# Altium project ChassisPowerDistroA_1.1_GK.PrjPcb
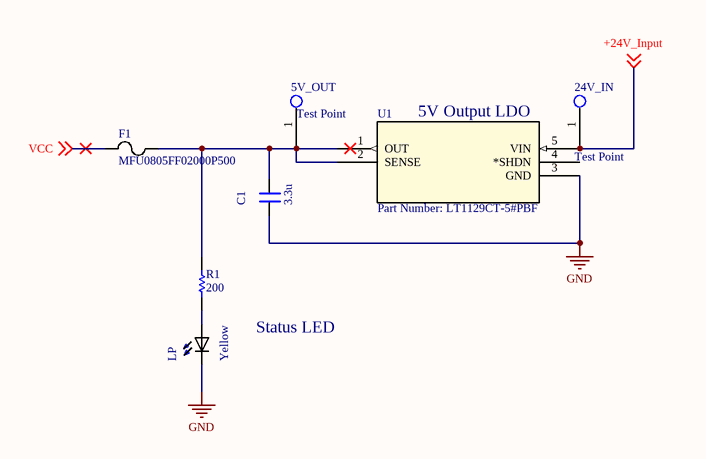
[diagram p0: Local_Power_5V_Rev1.1.SchDoc]
6 sheets, 197 parts. Net scope: global (net labels, ports and power ports of the same name join across sheets).
Board file: ChassisPowerDistroA_PSoC_1.1_GK.PcbDoc
Sheets:
  Local_Power_5V_Rev1.1.SchDoc
  MCU_PSoC_Rev1.1.SchDoc
  Power_12V_Rev1.1.SchDoc
  Power_3.3V_Rev1.1.SchDoc
  Power_5V_Rev1.1.SchDoc
  Power_24V_Rev1.1.SchDoc

## Sheet Local_Power_5V_Rev1.1.SchDoc
size A4

### Parts
5V_OUT  Test Point  [Test Point Through-hole]
24V_IN  Test Point  [Test Point Through-hole]
C1  3.3u  [*CAPC2012X88N]
F1  MFU0805FF02000P500  [FUS_VISHAY_MFU08]
LP  Yellow  [*DIOC200X125X110_LTST-C171KSKT(Primary)]
R1  200  [RESC0805(2012)_M]
U1  Part Number: LT1129CT-5#PBF  [TO220-5_T]

### Nets
GND: C1.1 LP.NEG U1.3(GND)
+24V_Input: 24V_IN.1 U1.5(VIN) ; off-sheet +24V_Input
VCC: F1.1 ; off-sheet VCC
Net5V_OUT_1: 5V_OUT.1 C1.2 F1.2 R1.2 U1.1(OUT) U1.2(SENSE)
NetLP_POS: LP.POS R1.1

Not connected (* = marked no-connect by the designer): U1 4(*SHDN)

### Notes on the sheet
- (near U1) 5V Output LDO
- Status LED
- Title
- Size:
- Date:
- A4
- Number:
- Time:
- Revision:
- Sheet
- of
- File:

### Library data of the parts
C1 = C0805C101JAGAC7800: / 100pF Â±5% 250V Ceramic Capacitor C0G, NP0 0805 _2012 Metric_ /; MF: KEMET; Package: 0805 KEMET; Digi-Key_Part_Number: 399-15000-1-ND; MP: C0805C101JAGAC7800; Digi-Key_Purchase_URL: https://www.digikey.com/product-detail/en/kemet/C0805C101JAGAC7800/399-15000-1-ND/7382549?utm_source=snapeda&utm_medium=aggregator&utm_campaign=symbol; SnapEDA_Link: https://www.snapeda.com/parts/C0805C101JAGAC7800/KEMET/view-part/3661430/?ref=snap; Value: *
F1 = MFU0805FF02000P5: No Description Available; Vendor: VISHAY; Built_By: EMA_UL_Team; Type: DEV; Manufacturer_Part_Number: MFU0805FF02000P500; Copyright: Copyright (C) 2018 Accelerated Designs. All rights reserved; RefDes: RefDes; Value: Value
LP = LTST-C171KSKT: / Yellow 2 x 1.25 x 0.8 mm 130Â° Water Clear 50 mcd 2 V LED SMT /; MF: Lite-On Inc.; SnapEDA_Link: https://www.snapeda.com/parts/LTST-C171KSKT/Lite-On%20Inc./view-part/?ref=snap; Package: 0805 Lite-On; MP: LTST-C171KSKT; Digi-Key_Part_Number: 160-1428-1-ND; Digi-Key_Purchase_URL: https://www.digikey.com/product-detail/en/lite-on-inc/LTST-C171KSKT/160-1428-1-ND/386802?utm_source=snapeda&utm_medium=aggregator&utm_campaign=symbol; Value: *
R1 = CMP-1013-00951-1: 8M06 0.125W 1% 0805 (2012 Metric)  SMD; Value: 8060000.00 Ohm; Case-EIA: 0805; Case-Metric: 2012; Power: 0.125 W; Technology: SMT; Tolerance: 1 %
U1 = LT1129CT-5#PBF: No Description Available; Vendor: Linear Technology; Built_By: EMA_UL_Team; Manufacturer_Part_Number: LT1129CT-5#PBF; Copyright: Copyright (C) 2018 Accelerated Designs. All rights reserved; RefDes: RefDes; Type: DEV; Value: Value

## Sheet MCU_PSoC_Rev1.1.SchDoc
size A4
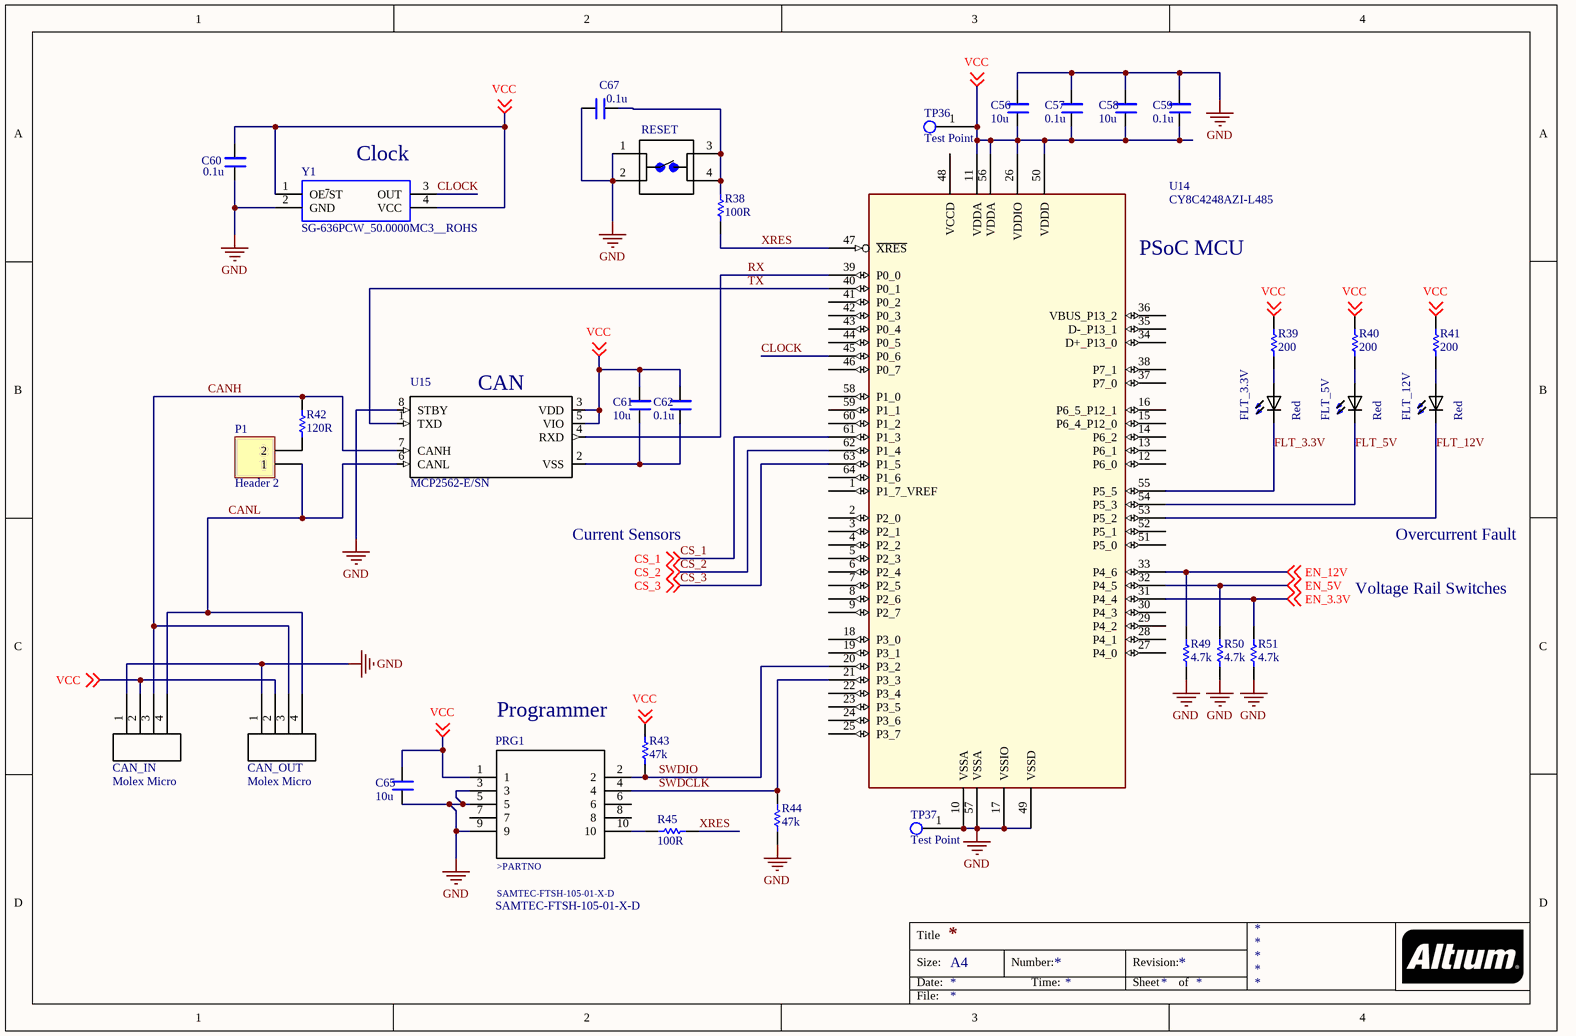
[diagram p1: MCU_PSoC_Rev1.1.SchDoc]

### Parts
C56  10u  [*CAPC2012X88N]
C57  0.1u  [*CAPC2012X88N]
C58  10u  [*CAPC2012X88N]
C59  0.1u  [*CAPC2012X88N]
C60  0.1u  [*CAPC2012X88N]
C61  10u  [*CAPC2012X88N]
C62  0.1u  [*CAPC2012X88N]
C65  10u  [*CAPC2012X88N]
C67  0.1u  [*CAPC2012X88N]
CAN_IN  Molex Micro  [0430450427]
CAN_OUT  Molex Micro  [0430450427]
FLT_3.3V  Red  [*DIOC200X125X110_LTST-C171KSKT(Primary)]
FLT_5V  Red  [*DIOC200X125X110_LTST-C171KSKT(Primary)]
FLT_12V  Red  [*DIOC200X125X110_LTST-C171KSKT(Primary)]
P1  Header 2  [HDR1X2]
PRG1  SAMTEC-FTSH-105-01-X-D  [SAMTEC-FTSH-105-01-X-D]
R38  100R  [RESC0805(2012)_M]
R39  200  [RESC0805(2012)_M]
R40  200  [RESC0805(2012)_M]
R41  200  [RESC0805(2012)_M]
R42  120R  [RESC0805(2012)_N]
R43  47k  [RESC0805(2012)_M]
R44  47k  [RESC0805(2012)_M]
R45  100R  [RESC0805(2012)_M]
R49  4.7k  [RESC0805(2012)_M]
R50  4.7k  [RESC0805(2012)_M]
R51  4.7k  [RESC0805(2012)_M]
RESET  1825910-7  [Switch 6mm 24V (NO)]  (value not drawn)
TP36  Test Point  [Test Point Through-hole]
TP37  Test Point  [Test Point Through-hole]
U14  CY8C4248AZI-L485  [TQFP50P1200X1200X160-64N]
U15  MCP2562-E/SN  [SOIC127P600X175-8N]
Y1  SG-636PCW_50.0000MC3__ROHS  [SG-636]

### Nets
GND: C56.2 C57.2 C58.2 C59.2 C60.1 C65.1 C67.1 CAN_IN.1 CAN_OUT.1 PRG1.3 PRG1.5 PRG1.9 R44.2 R49.2 R50.2 R51.2 RESET.1 RESET.2 TP37.1 U14.10(VSSA) U14.17(VSSIO) U14.49(VSSD) U14.57(VSSA) U15.8(STBY) Y1.2(GND)
CANH: CAN_IN.3 CAN_OUT.3 R42.2 U15.7(CANH)
CANL: CAN_IN.4 CAN_OUT.4 P1.1 U15.6(CANL)
CLOCK: U14.45(P0_6) Y1.3(OUT)
CS_1: U14.61(P1_3) ; off-sheet CS_1
CS_2: U14.62(P1_4) ; off-sheet CS_2
CS_3: U14.63(P1_5) ; off-sheet CS_3
EN_3.3V: R51.1 U14.31(P4_4) ; off-sheet EN_3.3V
EN_5V: R50.1 U14.32(P4_5) ; off-sheet EN_5V
EN_12V: R49.1 U14.33(P4_6) ; off-sheet EN_12V
FLT_3.3V: FLT_3.3V.NEG U14.55(P5_5)
FLT_5V: FLT_5V.NEG U14.54(P5_3)
FLT_12V: FLT_12V.NEG U14.53(P5_2)
RX: U14.39(P0_0) U15.4(RXD)
SWDCLK: PRG1.4 R44.1 U14.21(P3_3)
SWDIO: PRG1.2 R43.2 U14.20(P3_2)
TX: U14.40(P0_1) U15.1(TXD)
VCC: C56.1 C57.1 C58.1 C59.1 C60.2 C61.2 C62.2 C65.2 CAN_IN.2 CAN_OUT.2 PRG1.1 R39.2 R40.2 R41.2 R43.1 TP36.1 U14.11(VDDA) U14.26(VDDIO) U14.50(VDDD) U14.56(VDDA) U15.3(VDD) U15.5(VIO) Y1.1(OE~{/}ST) Y1.4(VCC) ; off-sheet VCC
XRES: R38.2 R45.1 U14.47(~{XRES})
NetC61_1: C61.1 C62.1 U15.2(VSS)
NetC67_2: C67.2 R38.1 RESET.3 RESET.4
NetFLT_3.3V_POS: FLT_3.3V.POS R39.1
NetFLT_5V_POS: FLT_5V.POS R40.1
NetFLT_12V_POS: FLT_12V.POS R41.1
NetP1_2: P1.2 R42.1
NetPRG1_10: PRG1.10 R45.2

Not connected (* = marked no-connect by the designer): PRG1 6 7 8; U14 1(P1_7_VREF) 2(P2_0) 3(P2_1) 4(P2_2) 5(P2_3) 6(P2_4) 7(P2_5) 8(P2_6) 9(P2_7) 12(P6_0) 13(P6_1) 14(P6_2) 15(P6_4_P12_0) 16(P6_5_P12_1) 18(P3_0) 19(P3_1) 22(P3_4) 23(P3_5) 24(P3_6) 25(P3_7) 27(P4_0) 28(P4_1) 29(P4_2) 30(P4_3) 34(D+_P13_0) 35(D-_P13_1) 36(VBUS_P13_2) 37(P7_0) 38(P7_1) 41(P0_2) 42(P0_3) 43(P0_4) 44(P0_5) 46(P0_7) 48(VCCD) 51(P5_0) 52(P5_1) 58(P1_0) 59(P1_1) 60(P1_2) 64(P1_6)

### Notes on the sheet
- (near Y1) Clock
- (near U14) PSoC MCU
- (near U15) CAN
- Current Sensors
- Overcurrent Fault
- Voltage Rail Switches
- Programmer
- Title
- Size:
- Date:
- A4
- Number:
- Time:
- Revision:
- Sheet
- of
- File:
- (in symbol SAMTEC-FTSH-105-01-X-D) >PARTNO

### Library data of the parts
C56-C62 C65 C67 = C0805C101JAGAC7800: as C1 on sheet Local_Power_5V_Rev1.1; Package: 0805 KEMET; Digi-Key_Part_Number: 399-15000-1-ND; MP: C0805C101JAGAC7800; Digi-Key_Purchase_URL: https://www.digikey.com/product-detail/en/kemet/C0805C101JAGAC7800/399-15000-1-ND/7382549?utm_source=snapeda&utm_medium=aggregator&utm_campaign=symbol; SnapEDA_Link: https://www.snapeda.com/parts/C0805C101JAGAC7800/KEMET/view-part/3661430/?ref=snap; Value: *
CAN_IN CAN_OUT = Molex micro-fit 4-pin (Single row schematic): Molex micro-fit 3.0 dual row header. P/N 0430450427
FLT_3.3V FLT_5V FLT_12V = LTST-C171KSKT: as LP on sheet Local_Power_5V_Rev1.1; SnapEDA_Link: https://www.snapeda.com/parts/LTST-C171KSKT/Lite-On%20Inc./view-part/?ref=snap; Package: 0805 Lite-On; MP: LTST-C171KSKT; Digi-Key_Part_Number: 160-1428-1-ND; Digi-Key_Purchase_URL: https://www.digikey.com/product-detail/en/lite-on-inc/LTST-C171KSKT/160-1428-1-ND/386802?utm_source=snapeda&utm_medium=aggregator&utm_campaign=symbol; Value: *
P1 = Header 2: Header, 2-Pin; LatestRevisionDate: 17-Jul-2002; LatestRevisionNote: Re-released for DXP Platform.; Publisher: Altium Limited
PRG1 = SAMTEC-FTSH-105-01-X-D: SAMTEC-FTSH-105-01-X-D. Shrouded 10-pin header with .05 in pitch.
R38-R41 R43-R45 R49-R51 = CMP-1013-00951-1: as R1 on sheet Local_Power_5V_Rev1.1; Power: 0.125 W; Technology: SMT; Tolerance: 1 %
R42 = 120R 5% 0805: 120R 0.125W 5% 0805 (2012 Metric)  SMD; Case-Metric: 2012; Value: 120.00 Ohm; Case-EIA: 0805; Tolerance: 5 %; Technology: SMT; Power: 0.125 W
RESET = Switch 6mm 24V (NO): FSM4JAH=6MM TACT SWITCH, HIGH TEMP; MF: TE Connectivity; Contact_Current_Rating: 50 mA; Configuration_Pole-Throw: Single Pole - Single Throw; Package: None; Digi-Key_Part_Number: 450-1804-ND; Digi-Key_Purchase_URL: https://www.digikey.com/product-detail/en/te-connectivity-alcoswitch-switches/1825910-7/450-1804-ND/1731414?utm_source=snapeda&utm_medium=aggregator&utm_campaign=symbol; MP: 1825910-7; SnapEDA_Link: https://www.snapeda.com/parts/1825910-7/TE%20Connectivity%20ALCOSWITCH%20Switches/view-part/?ref=snap; EU_RoHS_Compliance: Compliant; TE_purchase_URL: https://www.te.com/usa-en/product-1825910-7.html?te_bu=Cor&te_type=disp&te_campaign=seda_glo_cor-seda-global-disp-prtnr-fy19-seda-model-bom-cta_sma-317_1&elqCampaignId=32493; Value: *
U15 = MCP2562-E/SN: Microchip MCP2562-E/SN, CAN Transceiver 1MBps 1-channel IEC 61000-4-2, 8-Pin SOIC; Price: None; MF: Microchip; SnapEDA_Link: https://www.snapeda.com/parts/MCP2562-E/SN/Microchip/view-part/?ref=snap; MP: MCP2562-E/SN; Availability: Unavailable; Package: SO-8 Microchip; Value: *
Y1 = SG-636: Standard Clock Oscillators 50MHz 3.3Volt 100ppm -20C +70C; Manufacturer_Name: Epson Timing; Manufacturer_Part_Number: SG-636PCW 50.0000MC3: ROHS; RS Part Number: *; RS Price/Stock: *; Arrow Part Number: SG-636PCW 50.0000MC3: ROHS; Arrow Price/Stock: *; Datasheet Link: http://www.mouser.com/ds/2/137/G-636PCE_en-1003252.pdf
U14 = CY8C4248AZI-L485: Part_Number: CY8C4248AZI-L485

## Sheet Power_12V_Rev1.1.SchDoc
size B
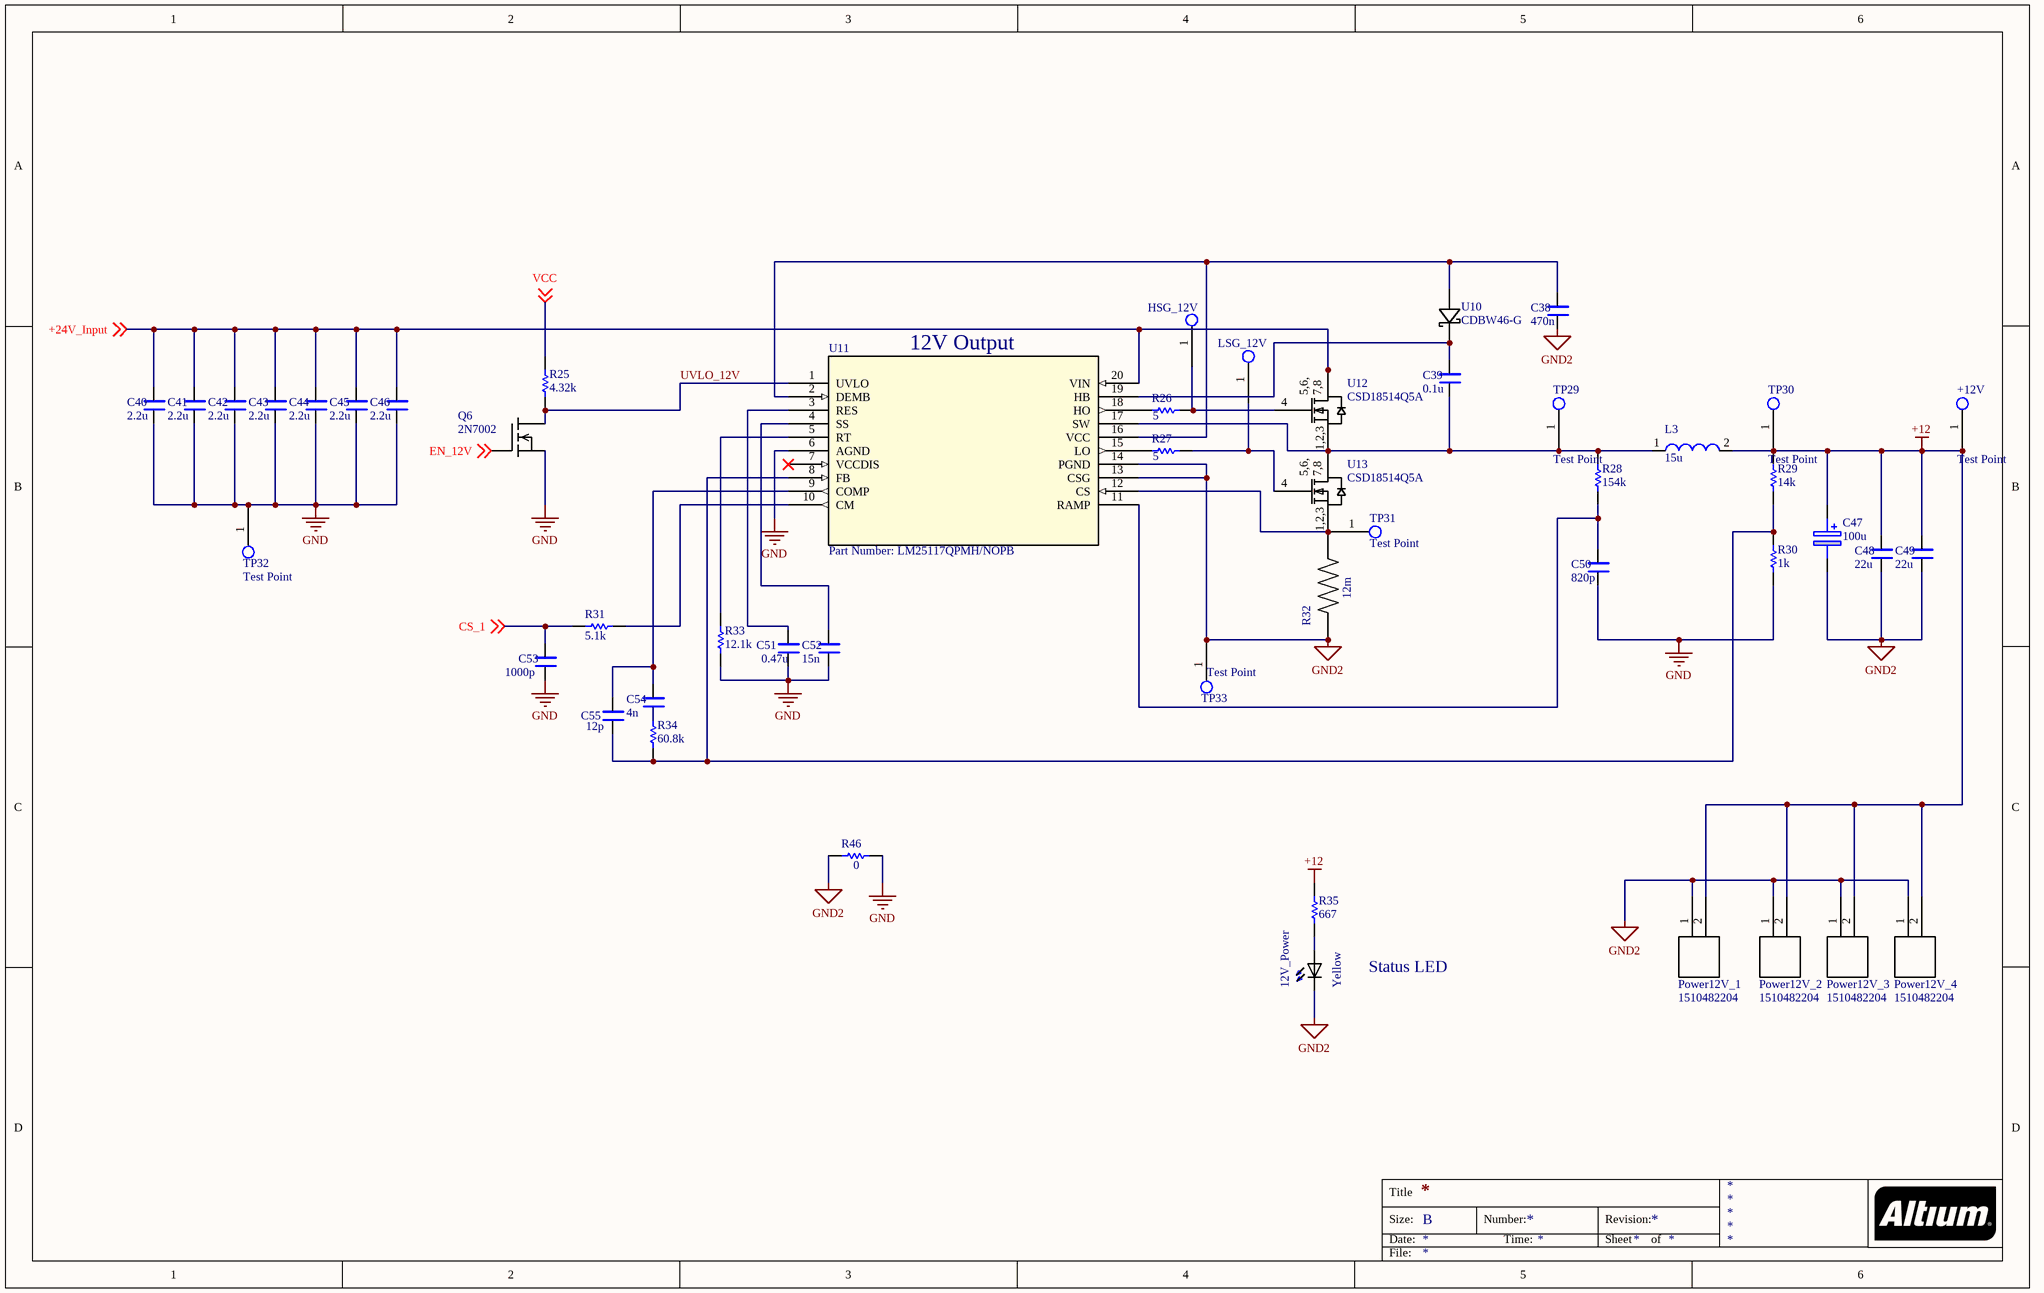
[diagram p2: Power_12V_Rev1.1.SchDoc]

### Parts
12V_Power  Yellow  [*DIOC200X125X110_LTST-C171KSKT(Primary)]
+12V  Test Point  [Test Point Through-hole]
C38  470n  [*CAPC2012X88N]
C39  0.1u  [*CAPC2012X88N]
C40  2.2u  [*CAPC2012X88N]
C41  2.2u  [*CAPC2012X88N]
C42  2.2u  [*CAPC2012X88N]
C43  2.2u  [*CAPC2012X88N]
C44  2.2u  [*CAPC2012X88N]
C45  2.2u  [*CAPC2012X88N]
C46  2.2u  [*CAPC2012X88N]
C47  100u  [CAPPRD500W65D1000H1800]
C48  22u  [*CAPC2012X88N]
C49  22u  [*CAPC2012X88N]
C50  820p  [*CAPC2012X88N]
C51  0.47u  [*CAPC2012X88N]
C52  15n  [*CAPC2012X88N]
C53  1000p  [*CAPC2012X88N]
C54  4n  [*CAPC2012X88N]
C55  12p  [*CAPC2012X88N]
HSG_12V  (no value)  [Test Point Through-hole]
L3  15u  [XAL1010-682]
LSG_12V  (no value)  [Test Point Through-hole]
Power12V_1  1510482204  [1510482204]
Power12V_2  1510482204  [1510482204]
Power12V_3  1510482204  [1510482204]
Power12V_4  1510482204  [1510482204]
Q6  2N7002  [*SOT23]
R25  4.32k  [RESC0805(2012)_M]
R26  5  [AXIAL-0.3]
R27  5  [AXIAL-0.3]
R28  154k  [RESC0805(2012)_M]
R29  14k  [RESC0805(2012)_M]
R30  1k  [RESC0805(2012)_M]
R31  5.1k  [RESC0805(2012)_M]
R32  12m  [*RESC6432X110N]
R33  12.1k  [RESC0805(2012)_M]
R34  60.8k  [RESC0805(2012)_M]
R35  667  [RESC0805(2012)_M]
R46  0  [RESC0805(2012)_M]
TP29  Test Point  [Test Point Through-hole]
TP30  Test Point  [Test Point Through-hole]
TP31  Test Point  [Test Point Through-hole]
TP32  Test Point  [Test Point Through-hole]
TP33  Test Point  [Test Point Through-hole]
U10  CDBW46-G  [CDBW]
U11  Part Number: LM25117QPMH/NOPB  [MXA20A]
U12  CSD18514Q5A  [DQJ0008A]
U13  CSD18514Q5A  [DQJ0008A]

### Nets
+12: +12V.1 C47.1(+) C48.2 C49.2 L3.2 Power12V_1.2 Power12V_2.2 Power12V_3.2 Power12V_4.2 R29.2 R35.2 TP30.1
GND: C40.1 C41.1 C42.1 C43.1 C44.1 C45.1 C46.1 C50.1 C51.1 C52.1 C53.1 Q6.2(S) R30.1 R33.1 R46.1 TP32.1 U11.6(AGND)
GND2: 12V_Power.NEG C38.1 C47.2(-) C48.1 C49.1 Power12V_1.1 Power12V_2.1 Power12V_3.1 Power12V_4.1 R32.1 R46.2 TP33.1 U11.13(CSG) U11.14(PGND)
+24V_Input: C40.2 C41.2 C42.2 C43.2 C44.2 C45.2 C46.2 U11.20(VIN) U12.5(D) U12.6(D) U12.7(D) U12.8(D) ; off-sheet +24V_Input
CS_1: C53.2 R31.2 ; off-sheet CS_1
EN_12V: Q6.1(G) ; off-sheet EN_12V
UVLO_12V: Q6.3(D) R25.1 U11.1(UVLO)
VCC: R25.2 ; off-sheet VCC
Net12V_Power_POS: 12V_Power.POS R35.1
NetC38_2: C38.2 U10.2 U11.2(DEMB) U11.16(VCC)
NetC39_1: C39.1 L3.1 R28.2 TP29.1 U11.17(SW) U12.1(S) U12.2(S) U12.3(S) U13.5(D) U13.6(D) U13.7(D) U13.8(D)
NetC39_2: C39.2 U10.1 U11.19(HB)
NetC50_2: C50.2 R28.1 U11.11(RAMP)
NetC51_2: C51.2 U11.3(RES)
NetC52_2: C52.2 U11.4(SS)
NetC54_1: C54.1 R34.2
NetC54_2: C54.2 C55.2 U11.9(COMP)
NetC55_1: C55.1 R29.1 R30.2 R34.1 U11.8(FB)
NetHSG_12V_1: HSG_12V.1 R26.2 U12.4(G)
NetLSG_12V_1: LSG_12V.1 R27.2 U13.4(G)
NetR26_1: R26.1 U11.18(HO)
NetR27_1: R27.1 U11.15(LO)
NetR31_1: R31.1 U11.10(CM)
NetR32_2: R32.2 TP31.1 U11.12(CS) U13.1(S) U13.2(S) U13.3(S)
NetR33_2: R33.2 U11.5(RT)

Not connected (* = marked no-connect by the designer): U11 7(VCCDIS)*

### Notes on the sheet
- (near U11) 12V Output
- Status LED
- Title
- Size:
- Date:
- B
- Number:
- Time:
- Revision:
- Sheet
- of
- File:
- (in symbol CSD18514Q5A) 5,6,; 7,8; 1,2,3

### Library data of the parts
12V_Power = LTST-C171KSKT: as LP on sheet Local_Power_5V_Rev1.1; SnapEDA_Link: https://www.snapeda.com/parts/LTST-C171KSKT/Lite-On%20Inc./view-part/?ref=snap; Package: 0805 Lite-On; MP: LTST-C171KSKT; Digi-Key_Part_Number: 160-1428-1-ND; Digi-Key_Purchase_URL: https://www.digikey.com/product-detail/en/lite-on-inc/LTST-C171KSKT/160-1428-1-ND/386802?utm_source=snapeda&utm_medium=aggregator&utm_campaign=symbol; Value: *
C38-C46 C48-C55 = C0805C101JAGAC7800: as C1 on sheet Local_Power_5V_Rev1.1; Package: 0805 KEMET; Digi-Key_Part_Number: 399-15000-1-ND; MP: C0805C101JAGAC7800; Digi-Key_Purchase_URL: https://www.digikey.com/product-detail/en/kemet/C0805C101JAGAC7800/399-15000-1-ND/7382549?utm_source=snapeda&utm_medium=aggregator&utm_campaign=symbol; SnapEDA_Link: https://www.snapeda.com/parts/C0805C101JAGAC7800/KEMET/view-part/3661430/?ref=snap; Value: *
C47 = EEUFC1V331: FC radial elec cap,330uF 35V Panasonic Aluminium Electrolytic Capacitor 330F 35 V dc 10mm Through Hole series FC Radial lifetime 3000h; Allied_Number: 70068521; Geometry.Height: 18mm; Manufacturer_Name: Panasonic; Manufacturer_Part_Number: EEUFC1V331; RS Part Number: 1081337; RS Price/Stock: http://uk.rs-online.com/web/p/products/1081337; Allied Price/Stock: https://www.alliedelec.com/panasonic-eeufc1v331/70068521/; Mouser Part Number: 1081337; Mouser Price/Stock: http://uk.rs-online.com/web/p/products/1081337; Datasheet Link: https://industrial.panasonic.com/cdbs/www-data/pdf/RDF0000/ABA0000C1209.pdf
HSG_12V LSG_12V = Test Point
L3 = SER2915H-153KL: Power inductor, high current, 10% tol, SMT, RoHS; MF: Coilcraft; Price: None; Package: None; SnapEDA_Link: https://www.snapeda.com/parts/SER2915H-153KL/Coilcraft/view-part/493862/?ref=snap; Availability: Unavailable; MP: SER2915H-153KL; Value: *
Power12V_1-Power12V_4 = 1510482204: Molex 6.5MM 2 pin connector, used for power connections. P/N 1510482204 and similar models.
Q6 = 2N7002: Trans MOSFET N-CH 60V 0.115A 3-Pin SOT-23 T/R; MF: ON Semiconductor; Price: None; SnapEDA_Link: https://www.snapeda.com/parts/2N7002/ON%20Semiconductor/view-part/4449003/?ref=snap; Availability: Unavailable; Package: SOT-23-3 ON Semiconductor; MP: 2N7002; Value: *
R25 R28-R31 R33-R35 R46 = CMP-1013-00951-1: as R1 on sheet Local_Power_5V_Rev1.1; Power: 0.125 W; Technology: SMT; Tolerance: 1 %
R26 R27 = 120R 5% 0805: as R42 on sheet MCU_PSoC_Rev1.1; Tolerance: 5 %; Technology: SMT; Power: 0.125 W
R32 = ERJ-M1WSF12MU: Res Thick Film 2512 0.012 Ohm 1% 1W Pad SMD Automotive T/R; MF: Panasonic; MP: ERJ-M1WSF12MU; Package: 6432 Panasonic Electronic Components; Digi-Key_Purchase_URL: https://www.digikey.com/product-detail/en/panasonic-electronic-components/ERJ-M1WSF12MU/P12MCT-ND/300474?utm_source=snapeda&utm_medium=aggregator&utm_campaign=symbol; Digi-Key_Part_Number: P12MCT-ND; SnapEDA_Link: https://www.snapeda.com/parts/ERJ-M1WSF12MU/Panasonic/view-part/?ref=snap; Value: *
U10 = CDBW46-G: No Description Available; Vendor: Comchip; Built_By: EMA_UL_Team; Manufacturer_Part_Number: CDBW46-G; Copyright: Copyright (C) 2018 Accelerated Designs. All rights reserved; RefDes: RefDes; Type: DEV; Value: Value
U11 = LM25117QPMH/NOPB: No Description Available; Manufacturer: Texas Instruments; Built_By: EMA_UL_Team; Manufacturer_Part_Number: LM25117QPMH/NOPB; Vendor: Texas Instruments; Copyright: Copyright (C) 2018 Accelerated Designs. All rights reserved; RefDes: RefDes; Type: DEV; Value: Value
U12 U13 = CSD18514Q5A: No Description Available; Vendor: Texas Instruments; Built_By: Texas_Instrument_Team; Value: 40V; VALUE_2: Value; Manufacturer_Part_Number: CSD18514Q5A; Copyright: Copyright (C) 2018 Accelerated Designs. All rights reserved; RefDes: RefDes; Type: DEV

## Sheet Power_3.3V_Rev1.1.SchDoc
size B
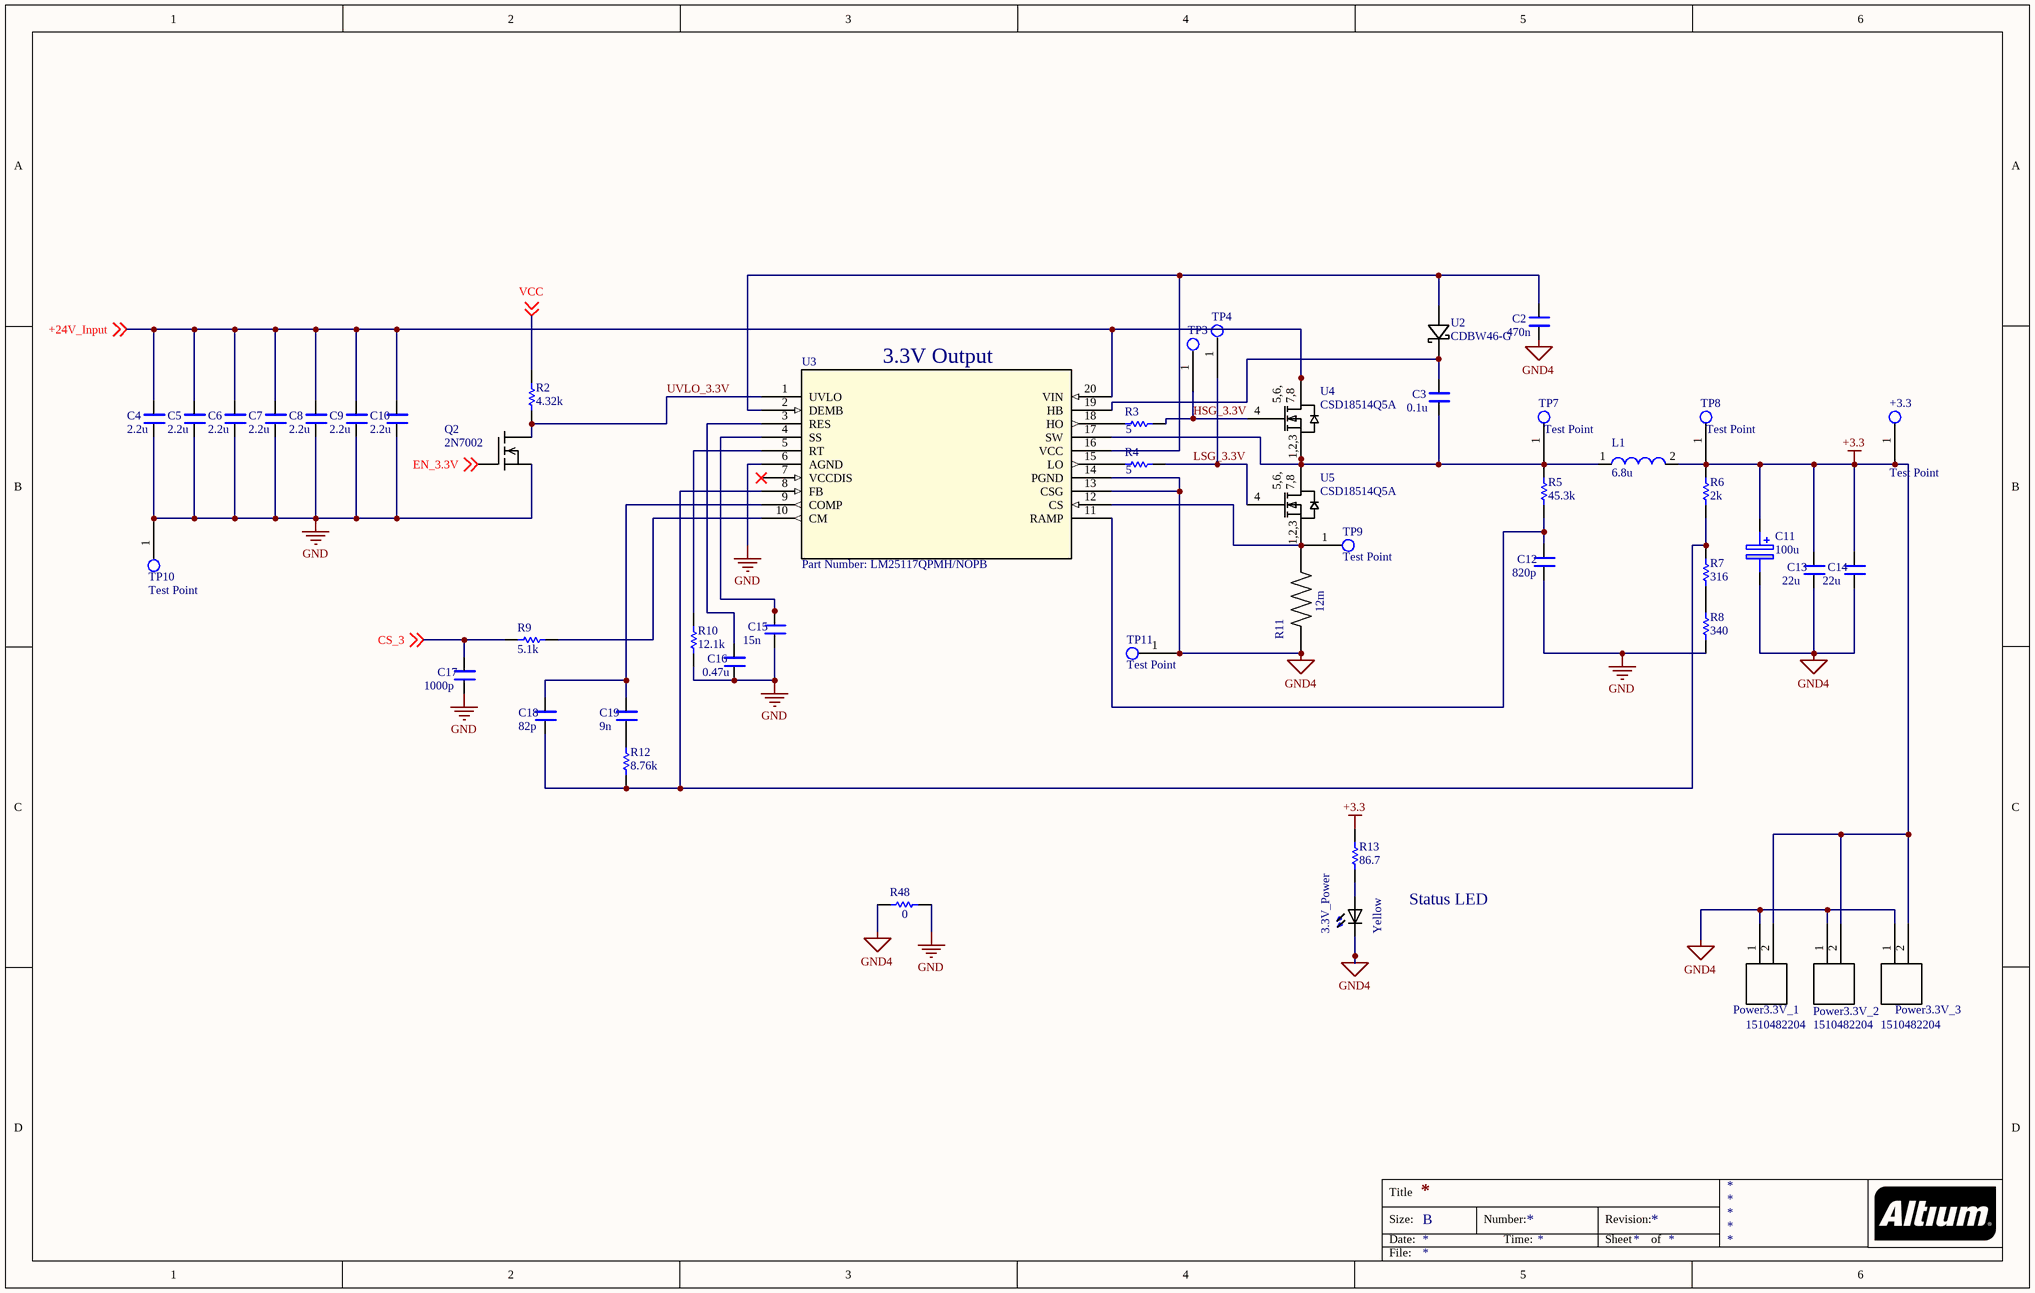
[diagram p3: Power_3.3V_Rev1.1.SchDoc]

### Parts
3.3V_Power  Yellow  [*DIOC200X125X110_LTST-C171KSKT(Primary)]
+3.3  Test Point  [Test Point Through-hole]
C2  470n  [*CAPC2012X88N]
C3  0.1u  [*CAPC2012X88N]
C4  2.2u  [*CAPC2012X88N]
C5  2.2u  [*CAPC2012X88N]
C6  2.2u  [*CAPC2012X88N]
C7  2.2u  [*CAPC2012X88N]
C8  2.2u  [*CAPC2012X88N]
C9  2.2u  [*CAPC2012X88N]
C10  2.2u  [*CAPC2012X88N]
C11  100u  [CAPPRD500W65D1000H1800]
C12  820p  [*CAPC2012X88N]
C13  22u  [*CAPC2012X88N]
C14  22u  [*CAPC2012X88N]
C15  15n  [*CAPC2012X88N]
C16  0.47u  [*CAPC2012X88N]
C17  1000p  [*CAPC2012X88N]
C18  82p  [*CAPC2012X88N]
C19  9n  [*CAPC2012X88N]
L1  6.8u  [XAL1010-682]
Power3.3V_1  1510482204  [1510482204]
Power3.3V_2  1510482204  [1510482204]
Power3.3V_3  1510482204  [1510482204]
Q2  2N7002  [*SOT23]
R2  4.32k  [RESC0805(2012)_M]
R3  5  [AXIAL-0.3]
R4  5  [AXIAL-0.3]
R5  45.3k  [RESC0805(2012)_M]
R6  2k  [RESC0805(2012)_M]
R7  316  [RESC0805(2012)_M]
R8  340  [RESC0805(2012)_M]
R9  5.1k  [RESC0805(2012)_M]
R10  12.1k  [RESC0805(2012)_M]
R11  12m  [*RESC6432X110N]
R12  8.76k  [RESC0805(2012)_M]
R13  86.7  [RESC0805(2012)_M]
R48  0  [RESC0805(2012)_M]
TP3  (no value)  [Test Point Through-hole]
TP4  (no value)  [Test Point Through-hole]
TP7  Test Point  [Test Point Through-hole]
TP8  Test Point  [Test Point Through-hole]
TP9  Test Point  [Test Point Through-hole]
TP10  Test Point  [Test Point Through-hole]
TP11  Test Point  [Test Point Through-hole]
U2  CDBW46-G  [CDBW]
U3  Part Number: LM25117QPMH/NOPB  [MXA20A]
U4  CSD18514Q5A  [DQJ0008A]
U5  CSD18514Q5A  [DQJ0008A]

### Nets
+3.3: +3.3.1 C11.1(+) C13.2 C14.2 L1.2 Power3.3V_1.2 Power3.3V_2.2 Power3.3V_3.2 R6.2 R13.2 TP8.1
GND: C4.1 C5.1 C6.1 C7.1 C8.1 C9.1 C10.1 C12.1 C15.1 C16.1 C17.1 Q2.2(S) R8.1 R10.1 R48.1 TP10.1 U3.6(AGND)
GND4: 3.3V_Power.NEG C2.1 C11.2(-) C13.1 C14.1 Power3.3V_1.1 Power3.3V_2.1 Power3.3V_3.1 R11.1 R48.2 TP11.1 U3.13(CSG) U3.14(PGND)
+24V_Input: C4.2 C5.2 C6.2 C7.2 C8.2 C9.2 C10.2 U3.20(VIN) U4.5(D) U4.6(D) U4.7(D) U4.8(D) ; off-sheet +24V_Input
CS_3: C17.2 R9.2 ; off-sheet CS_3
EN_3.3V: Q2.1(G) ; off-sheet EN_3.3V
HSG_3.3V: R3.2 TP3.1 U4.4(G)
LSG_3.3V: R4.2 TP4.1 U5.4(G)
UVLO_3.3V: Q2.3(D) R2.1 U3.1(UVLO)
VCC: R2.2 ; off-sheet VCC
Net3.3V_Power_POS: 3.3V_Power.POS R13.1
NetC2_2: C2.2 U2.2 U3.2(DEMB) U3.16(VCC)
NetC3_1: C3.1 L1.1 R5.2 TP7.1 U3.17(SW) U4.1(S) U4.2(S) U4.3(S) U5.5(D) U5.6(D) U5.7(D) U5.8(D)
NetC3_2: C3.2 U2.1 U3.19(HB)
NetC12_2: C12.2 R5.1 U3.11(RAMP)
NetC15_2: C15.2 U3.4(SS)
NetC16_2: C16.2 U3.3(RES)
NetC18_1: C18.1 R6.1 R7.2 R12.1 U3.8(FB)
NetC18_2: C18.2 C19.2 U3.9(COMP)
NetC19_1: C19.1 R12.2
NetR3_1: R3.1 U3.18(HO)
NetR4_1: R4.1 U3.15(LO)
NetR7_1: R7.1 R8.2
NetR9_1: R9.1 U3.10(CM)
NetR10_2: R10.2 U3.5(RT)
NetR11_2: R11.2 TP9.1 U3.12(CS) U5.1(S) U5.2(S) U5.3(S)

Not connected (* = marked no-connect by the designer): U3 7(VCCDIS)*

### Notes on the sheet
- (near U3) 3.3V Output
- Status LED
- Title
- Size:
- Date:
- B
- Number:
- Time:
- Revision:
- Sheet
- of
- File:
- (in symbol CSD18514Q5A) 5,6,; 7,8; 1,2,3

### Library data of the parts
3.3V_Power = LTST-C171KSKT: as LP on sheet Local_Power_5V_Rev1.1; SnapEDA_Link: https://www.snapeda.com/parts/LTST-C171KSKT/Lite-On%20Inc./view-part/?ref=snap; Package: 0805 Lite-On; MP: LTST-C171KSKT; Digi-Key_Part_Number: 160-1428-1-ND; Digi-Key_Purchase_URL: https://www.digikey.com/product-detail/en/lite-on-inc/LTST-C171KSKT/160-1428-1-ND/386802?utm_source=snapeda&utm_medium=aggregator&utm_campaign=symbol; Value: *
C2-C10 C12-C19 = C0805C101JAGAC7800: as C1 on sheet Local_Power_5V_Rev1.1; Package: 0805 KEMET; Digi-Key_Part_Number: 399-15000-1-ND; MP: C0805C101JAGAC7800; Digi-Key_Purchase_URL: https://www.digikey.com/product-detail/en/kemet/C0805C101JAGAC7800/399-15000-1-ND/7382549?utm_source=snapeda&utm_medium=aggregator&utm_campaign=symbol; SnapEDA_Link: https://www.snapeda.com/parts/C0805C101JAGAC7800/KEMET/view-part/3661430/?ref=snap; Value: *
C11 = EEUFC1V331: as C47 on sheet Power_12V_Rev1.1; Manufacturer_Name: Panasonic; Manufacturer_Part_Number: EEUFC1V331; RS Part Number: 1081337; RS Price/Stock: http://uk.rs-online.com/web/p/products/1081337; Allied Price/Stock: https://www.alliedelec.com/panasonic-eeufc1v331/70068521/; Mouser Part Number: 1081337; Mouser Price/Stock: http://uk.rs-online.com/web/p/products/1081337; Datasheet Link: https://industrial.panasonic.com/cdbs/www-data/pdf/RDF0000/ABA0000C1209.pdf
L1 = SER2915H-153KL: as L3 on sheet Power_12V_Rev1.1; Price: None; Package: None; SnapEDA_Link: https://www.snapeda.com/parts/SER2915H-153KL/Coilcraft/view-part/493862/?ref=snap; Availability: Unavailable; MP: SER2915H-153KL; Value: *
Power3.3V_1-Power3.3V_3 = 1510482204: as Power12V_1 on sheet Power_12V_Rev1.1
Q2 = 2N7002: as Q6 on sheet Power_12V_Rev1.1; Price: None; SnapEDA_Link: https://www.snapeda.com/parts/2N7002/ON%20Semiconductor/view-part/4449003/?ref=snap; Availability: Unavailable; Package: SOT-23-3 ON Semiconductor; MP: 2N7002; Value: *
R2 R5-R10 R12 R13 R48 = CMP-1013-00951-1: as R1 on sheet Local_Power_5V_Rev1.1; Power: 0.125 W; Technology: SMT; Tolerance: 1 %
R3 R4 = 120R 5% 0805: as R42 on sheet MCU_PSoC_Rev1.1; Tolerance: 5 %; Technology: SMT; Power: 0.125 W
R11 = ERJ-M1WSF12MU: as R32 on sheet Power_12V_Rev1.1; MP: ERJ-M1WSF12MU; Package: 6432 Panasonic Electronic Components; Digi-Key_Purchase_URL: https://www.digikey.com/product-detail/en/panasonic-electronic-components/ERJ-M1WSF12MU/P12MCT-ND/300474?utm_source=snapeda&utm_medium=aggregator&utm_campaign=symbol; Digi-Key_Part_Number: P12MCT-ND; SnapEDA_Link: https://www.snapeda.com/parts/ERJ-M1WSF12MU/Panasonic/view-part/?ref=snap; Value: *
TP3 TP4 = Test Point
U2 = CDBW46-G: as U10 on sheet Power_12V_Rev1.1; Manufacturer_Part_Number: CDBW46-G; Copyright: Copyright (C) 2018 Accelerated Designs. All rights reserved; RefDes: RefDes; Type: DEV; Value: Value
U3 = LM25117QPMH/NOPB: as U11 on sheet Power_12V_Rev1.1; Manufacturer_Part_Number: LM25117QPMH/NOPB; Vendor: Texas Instruments; Copyright: Copyright (C) 2018 Accelerated Designs. All rights reserved; RefDes: RefDes; Type: DEV; Value: Value
U4 U5 = CSD18514Q5A: as U12 on sheet Power_12V_Rev1.1; Manufacturer_Part_Number: CSD18514Q5A; Copyright: Copyright (C) 2018 Accelerated Designs. All rights reserved; RefDes: RefDes; Type: DEV

## Sheet Power_5V_Rev1.1.SchDoc
size B
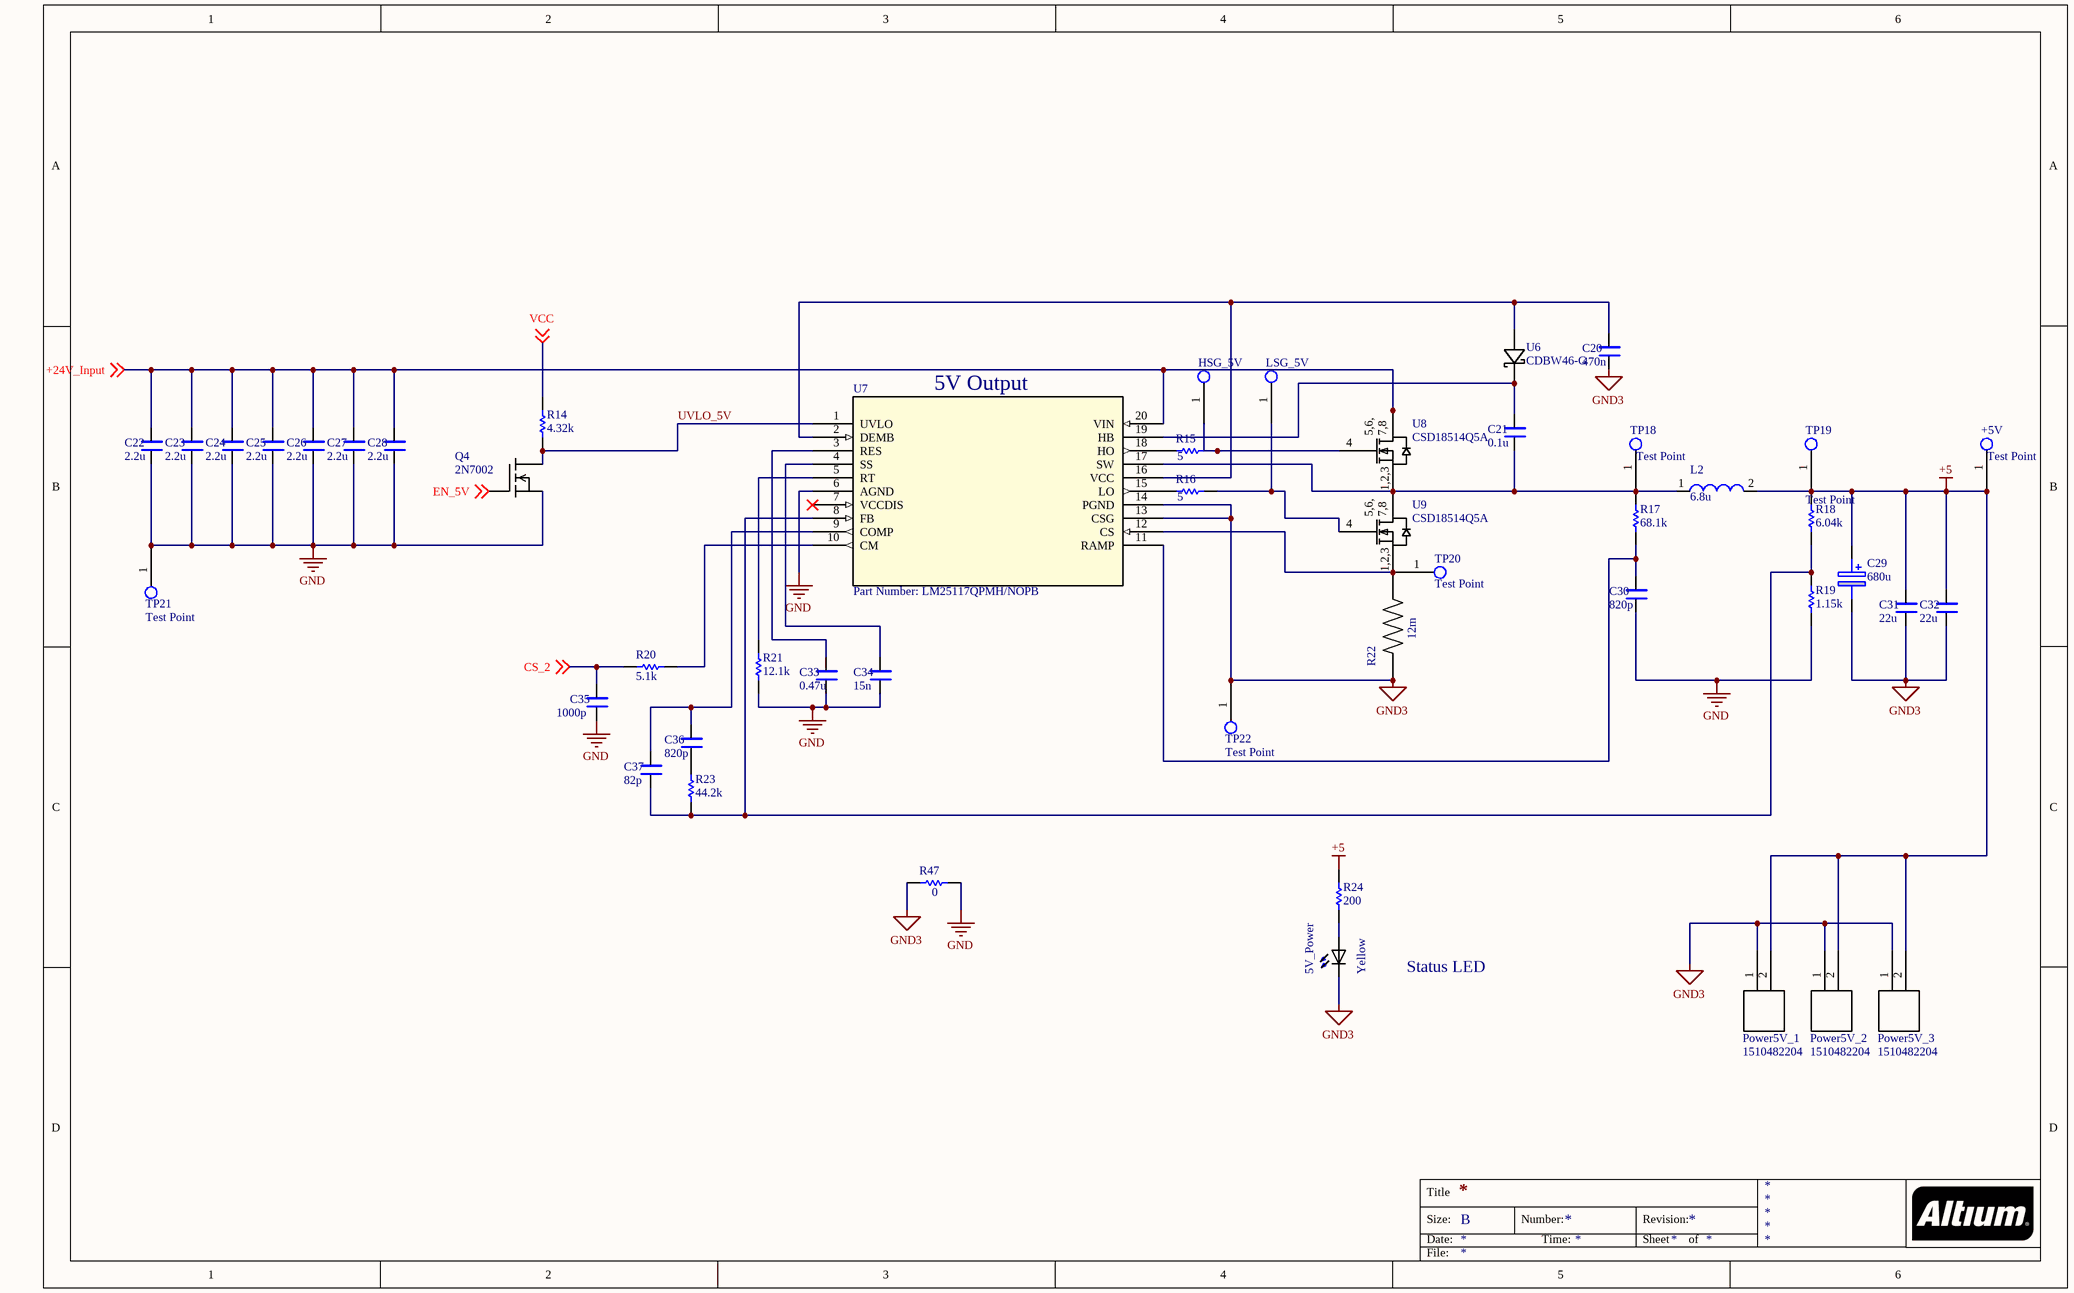
[diagram p4: Power_5V_Rev1.1.SchDoc]

### Parts
5V_Power  Yellow  [*DIOC200X125X110_LTST-C171KSKT(Primary)]
+5V  Test Point  [Test Point Through-hole]
C20  470n  [*CAPC2012X88N]
C21  0.1u  [*CAPC2012X88N]
C22  2.2u  [*CAPC2012X88N]
C23  2.2u  [*CAPC2012X88N]
C24  2.2u  [*CAPC2012X88N]
C25  2.2u  [*CAPC2012X88N]
C26  2.2u  [*CAPC2012X88N]
C27  2.2u  [*CAPC2012X88N]
C28  2.2u  [*CAPC2012X88N]
C29  680u  [CAPPRD500W65D1000H1800]
C30  820p  [*CAPC2012X88N]
C31  22u  [*CAPC2012X88N]
C32  22u  [*CAPC2012X88N]
C33  0.47u  [*CAPC2012X88N]
C34  15n  [*CAPC2012X88N]
C35  1000p  [*CAPC2012X88N]
C36  820p  [*CAPC2012X88N]
C37  82p  [*CAPC2012X88N]
HSG_5V  (no value)  [Test Point Through-hole]
L2  6.8u  [XAL1010-682]
LSG_5V  (no value)  [Test Point Through-hole]
Power5V_1  1510482204  [1510482204]
Power5V_2  1510482204  [1510482204]
Power5V_3  1510482204  [1510482204]
Q4  2N7002  [*SOT23]
R14  4.32k  [RESC0805(2012)_M]
R15  5  [AXIAL-0.3]
R16  5  [AXIAL-0.3]
R17  68.1k  [RESC0805(2012)_M]
R18  6.04k  [RESC0805(2012)_M]
R19  1.15k  [RESC0805(2012)_M]
R20  5.1k  [RESC0805(2012)_M]
R21  12.1k  [RESC0805(2012)_M]
R22  12m  [*RESC6432X110N]
R23  44.2k  [RESC0805(2012)_M]
R24  200  [RESC0805(2012)_M]
R47  0  [RESC0805(2012)_M]
TP18  Test Point  [Test Point Through-hole]
TP19  Test Point  [Test Point Through-hole]
TP20  Test Point  [Test Point Through-hole]
TP21  Test Point  [Test Point Through-hole]
TP22  Test Point  [Test Point Through-hole]
U6  CDBW46-G  [CDBW]
U7  Part Number: LM25117QPMH/NOPB  [MXA20A]
U8  CSD18514Q5A  [DQJ0008A]
U9  CSD18514Q5A  [DQJ0008A]

### Nets
+5: +5V.1 C29.1(+) C31.2 C32.2 L2.2 Power5V_1.2 Power5V_2.2 Power5V_3.2 R18.2 R24.2 TP19.1
GND: C22.1 C23.1 C24.1 C25.1 C26.1 C27.1 C28.1 C30.1 C33.1 C34.1 C35.1 Q4.2(S) R19.1 R21.1 R47.1 TP21.1 U7.6(AGND)
GND3: 5V_Power.NEG C20.1 C29.2(-) C31.1 C32.1 Power5V_1.1 Power5V_2.1 Power5V_3.1 R22.1 R47.2 TP22.1 U7.13(CSG) U7.14(PGND)
+24V_Input: C22.2 C23.2 C24.2 C25.2 C26.2 C27.2 C28.2 U7.20(VIN) U8.5(D) U8.6(D) U8.7(D) U8.8(D) ; off-sheet +24V_Input
CS_2: C35.2 R20.2 ; off-sheet CS_2
EN_5V: Q4.1(G) ; off-sheet EN_5V
UVLO_5V: Q4.3(D) R14.1 U7.1(UVLO)
VCC: R14.2 ; off-sheet VCC
Net5V_Power_POS: 5V_Power.POS R24.1
NetC20_2: C20.2 U6.2 U7.2(DEMB) U7.16(VCC)
NetC21_1: C21.1 L2.1 R17.2 TP18.1 U7.17(SW) U8.1(S) U8.2(S) U8.3(S) U9.5(D) U9.6(D) U9.7(D) U9.8(D)
NetC21_2: C21.2 U6.1 U7.19(HB)
NetC30_2: C30.2 R17.1 U7.11(RAMP)
NetC33_2: C33.2 U7.3(RES)
NetC34_2: C34.2 U7.4(SS)
NetC36_1: C36.1 R23.2
NetC36_2: C36.2 C37.2 U7.9(COMP)
NetC37_1: C37.1 R18.1 R19.2 R23.1 U7.8(FB)
NetHSG_5V_1: HSG_5V.1 R15.2 U8.4(G)
NetLSG_5V_1: LSG_5V.1 R16.2 U9.4(G)
NetR15_1: R15.1 U7.18(HO)
NetR16_1: R16.1 U7.15(LO)
NetR20_1: R20.1 U7.10(CM)
NetR21_2: R21.2 U7.5(RT)
NetR22_2: R22.2 TP20.1 U7.12(CS) U9.1(S) U9.2(S) U9.3(S)

Not connected (* = marked no-connect by the designer): U7 7(VCCDIS)*

### Notes on the sheet
- (near U7) 5V Output
- Status LED
- Title
- Size:
- Date:
- B
- Number:
- Time:
- Revision:
- Sheet
- of
- File:
- (in symbol CSD18514Q5A) 5,6,; 7,8; 1,2,3

### Library data of the parts
5V_Power = LTST-C171KSKT: as LP on sheet Local_Power_5V_Rev1.1; SnapEDA_Link: https://www.snapeda.com/parts/LTST-C171KSKT/Lite-On%20Inc./view-part/?ref=snap; Package: 0805 Lite-On; MP: LTST-C171KSKT; Digi-Key_Part_Number: 160-1428-1-ND; Digi-Key_Purchase_URL: https://www.digikey.com/product-detail/en/lite-on-inc/LTST-C171KSKT/160-1428-1-ND/386802?utm_source=snapeda&utm_medium=aggregator&utm_campaign=symbol; Value: *
C20-C28 C30-C37 = C0805C101JAGAC7800: as C1 on sheet Local_Power_5V_Rev1.1; Package: 0805 KEMET; Digi-Key_Part_Number: 399-15000-1-ND; MP: C0805C101JAGAC7800; Digi-Key_Purchase_URL: https://www.digikey.com/product-detail/en/kemet/C0805C101JAGAC7800/399-15000-1-ND/7382549?utm_source=snapeda&utm_medium=aggregator&utm_campaign=symbol; SnapEDA_Link: https://www.snapeda.com/parts/C0805C101JAGAC7800/KEMET/view-part/3661430/?ref=snap; Value: *
C29 = EEUFC1V331: as C47 on sheet Power_12V_Rev1.1; Manufacturer_Name: Panasonic; Manufacturer_Part_Number: EEUFC1V331; RS Part Number: 1081337; RS Price/Stock: http://uk.rs-online.com/web/p/products/1081337; Allied Price/Stock: https://www.alliedelec.com/panasonic-eeufc1v331/70068521/; Mouser Part Number: 1081337; Mouser Price/Stock: http://uk.rs-online.com/web/p/products/1081337; Datasheet Link: https://industrial.panasonic.com/cdbs/www-data/pdf/RDF0000/ABA0000C1209.pdf
HSG_5V LSG_5V = Test Point
L2 = SER2915H-153KL: as L3 on sheet Power_12V_Rev1.1; Price: None; Package: None; SnapEDA_Link: https://www.snapeda.com/parts/SER2915H-153KL/Coilcraft/view-part/493862/?ref=snap; Availability: Unavailable; MP: SER2915H-153KL; Value: *
Power5V_1-Power5V_3 = 1510482204: as Power12V_1 on sheet Power_12V_Rev1.1
Q4 = 2N7002: as Q6 on sheet Power_12V_Rev1.1; Price: None; SnapEDA_Link: https://www.snapeda.com/parts/2N7002/ON%20Semiconductor/view-part/4449003/?ref=snap; Availability: Unavailable; Package: SOT-23-3 ON Semiconductor; MP: 2N7002; Value: *
R14 R17-R21 R23 R24 R47 = CMP-1013-00951-1: as R1 on sheet Local_Power_5V_Rev1.1; Power: 0.125 W; Technology: SMT; Tolerance: 1 %
R15 R16 = 120R 5% 0805: as R42 on sheet MCU_PSoC_Rev1.1; Tolerance: 5 %; Technology: SMT; Power: 0.125 W
R22 = ERJ-M1WSF12MU: as R32 on sheet Power_12V_Rev1.1; MP: ERJ-M1WSF12MU; Package: 6432 Panasonic Electronic Components; Digi-Key_Purchase_URL: https://www.digikey.com/product-detail/en/panasonic-electronic-components/ERJ-M1WSF12MU/P12MCT-ND/300474?utm_source=snapeda&utm_medium=aggregator&utm_campaign=symbol; Digi-Key_Part_Number: P12MCT-ND; SnapEDA_Link: https://www.snapeda.com/parts/ERJ-M1WSF12MU/Panasonic/view-part/?ref=snap; Value: *
U6 = CDBW46-G: as U10 on sheet Power_12V_Rev1.1; Manufacturer_Part_Number: CDBW46-G; Copyright: Copyright (C) 2018 Accelerated Designs. All rights reserved; RefDes: RefDes; Type: DEV; Value: Value
U7 = LM25117QPMH/NOPB: as U11 on sheet Power_12V_Rev1.1; Manufacturer_Part_Number: LM25117QPMH/NOPB; Vendor: Texas Instruments; Copyright: Copyright (C) 2018 Accelerated Designs. All rights reserved; RefDes: RefDes; Type: DEV; Value: Value
U8 U9 = CSD18514Q5A: as U12 on sheet Power_12V_Rev1.1; Manufacturer_Part_Number: CSD18514Q5A; Copyright: Copyright (C) 2018 Accelerated Designs. All rights reserved; RefDes: RefDes; Type: DEV

## Sheet Power_24V_Rev1.1.SchDoc
size A4
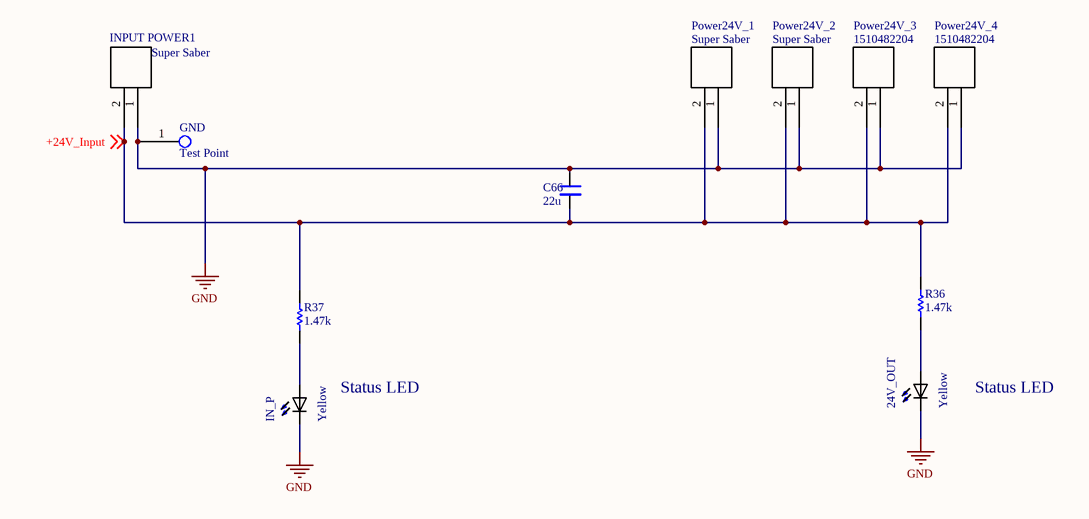
[diagram p5: Power_24V_Rev1.1.SchDoc]

### Parts
24V_OUT  Yellow  [*DIOC200X125X110_LTST-C171KSKT(Primary)]
C66  22u  [*CAPC2012X88N]
GND  Test Point  [Test Point Through-hole]
IN_P  Yellow  [*DIOC200X125X110_LTST-C171KSKT(Primary)]
INPUT_POWER1  Super Saber  [1720420202]
Power24V_1  Super Saber  [1720420202]
Power24V_2  Super Saber  [1720420202]
Power24V_3  1510482204  [1510482204]
Power24V_4  1510482204  [1510482204]
R36  1.47k  [RESC0805(2012)_M]
R37  1.47k  [RESC0805(2012)_M]

### Nets
GND: 24V_OUT.NEG C66.2 GND.1 IN_P.NEG INPUT_POWER1.1 Power24V_1.1 Power24V_2.1 Power24V_3.1 Power24V_4.1
+24V_Input: C66.1 INPUT_POWER1.2 Power24V_1.2 Power24V_2.2 Power24V_3.2 Power24V_4.2 R36.2 R37.2 ; off-sheet +24V_Input
Net24V_OUT_POS: 24V_OUT.POS R36.1
NetIN_P_POS: IN_P.POS R37.1

### Notes on the sheet
- Status LED
- Title
- Size:
- Date:
- A4
- Number:
- Time:
- Revision:
- Sheet
- of
- File:

### Library data of the parts
24V_OUT IN_P = LTST-C171KSKT: as LP on sheet Local_Power_5V_Rev1.1; SnapEDA_Link: https://www.snapeda.com/parts/LTST-C171KSKT/Lite-On%20Inc./view-part/?ref=snap; Package: 0805 Lite-On; MP: LTST-C171KSKT; Digi-Key_Part_Number: 160-1428-1-ND; Digi-Key_Purchase_URL: https://www.digikey.com/product-detail/en/lite-on-inc/LTST-C171KSKT/160-1428-1-ND/386802?utm_source=snapeda&utm_medium=aggregator&utm_campaign=symbol; Value: *
C66 = C0805C101JAGAC7800: as C1 on sheet Local_Power_5V_Rev1.1; Package: 0805 KEMET; Digi-Key_Part_Number: 399-15000-1-ND; MP: C0805C101JAGAC7800; Digi-Key_Purchase_URL: https://www.digikey.com/product-detail/en/kemet/C0805C101JAGAC7800/399-15000-1-ND/7382549?utm_source=snapeda&utm_medium=aggregator&utm_campaign=symbol; SnapEDA_Link: https://www.snapeda.com/parts/C0805C101JAGAC7800/KEMET/view-part/3661430/?ref=snap; Value: *
Power24V_3 Power24V_4 = 1510482204: as Power12V_1 on sheet Power_12V_Rev1.1
R36 R37 = CMP-1013-00951-1: as R1 on sheet Local_Power_5V_Rev1.1; Power: 0.125 W; Technology: SMT; Tolerance: 1 %

## Nets that join several sheets
GND: Local_Power_5V_Rev1.1 (C1.1 LP.NEG U1.3), MCU_PSoC_Rev1.1 (25 pins), Power_12V_Rev1.1 (17 pins), Power_3.3V_Rev1.1 (17 pins), Power_5V_Rev1.1 (17 pins), Power_24V_Rev1.1 (9 pins)
+24V_Input: Local_Power_5V_Rev1.1 (24V_IN.1 U1.5), Power_12V_Rev1.1 (12 pins), Power_3.3V_Rev1.1 (12 pins), Power_5V_Rev1.1 (12 pins), Power_24V_Rev1.1 (8 pins)
CS_1: MCU_PSoC_Rev1.1 (U14.61), Power_12V_Rev1.1 (C53.2 R31.2)
CS_2: MCU_PSoC_Rev1.1 (U14.62), Power_5V_Rev1.1 (C35.2 R20.2)
CS_3: MCU_PSoC_Rev1.1 (U14.63), Power_3.3V_Rev1.1 (C17.2 R9.2)
EN_3.3V: MCU_PSoC_Rev1.1 (R51.1 U14.31), Power_3.3V_Rev1.1 (Q2.1)
EN_5V: MCU_PSoC_Rev1.1 (R50.1 U14.32), Power_5V_Rev1.1 (Q4.1)
EN_12V: MCU_PSoC_Rev1.1 (R49.1 U14.33), Power_12V_Rev1.1 (Q6.1)
VCC: Local_Power_5V_Rev1.1 (F1.1), MCU_PSoC_Rev1.1 (24 pins), Power_12V_Rev1.1 (R25.2), Power_3.3V_Rev1.1 (R2.2), Power_5V_Rev1.1 (R14.2)